# Altium schematic sheet ControlBrick2_0.SchDoc
size A4
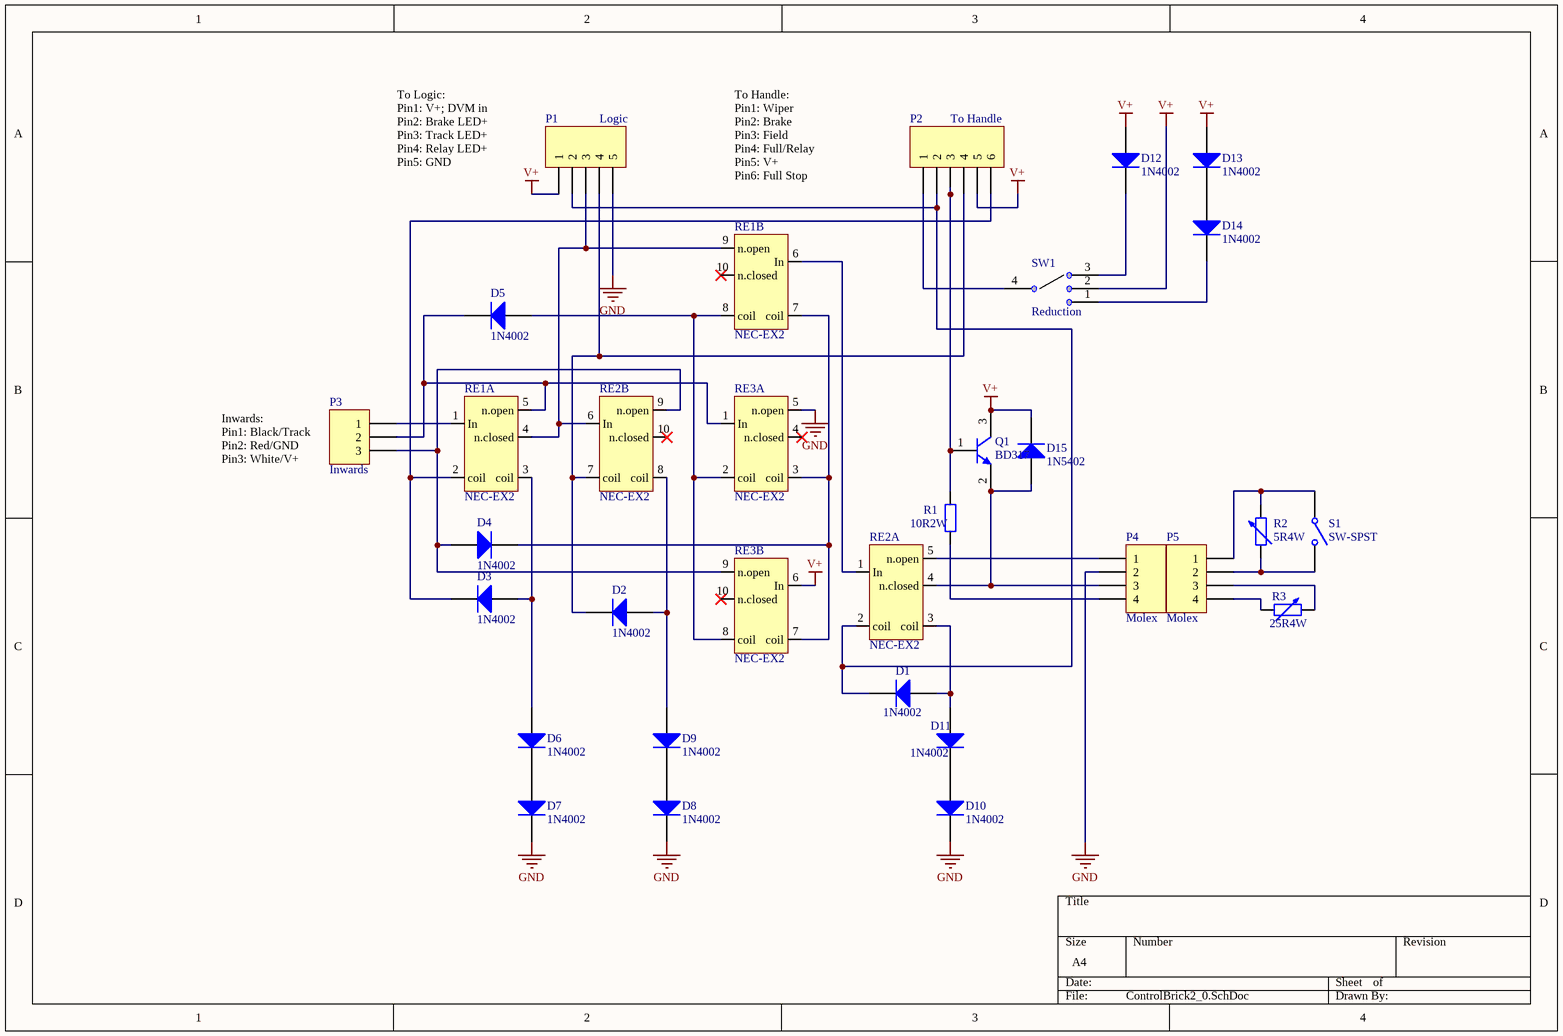
[diagram p0: ControlBrick2_0.SchDoc]

## Parts
D1  1N4002  [StdDiode]
D2  1N4002  [StdDiode]
D3  1N4002  [StdDiode]
D4  1N4002  [StdDiode]
D5  1N4002  [StdDiode]
D6  1N4002  [StdDiode]
D7  1N4002  [StdDiode]
D8  1N4002  [StdDiode]
D9  1N4002  [StdDiode]
D10  1N4002  [StdDiode]
D11  1N4002  [StdDiode]
D12  1N4002  [StdDiode]
D13  1N4002  [StdDiode]
D14  1N4002  [StdDiode]
D15  1N5402  [BigDiode]
P1  Logic  [HDR1X5]
P2  To Handle  [Interconnect]
P3  Inwards  [Inwards]
P4  Molex  [Molex_4x50.8]
P5  Molex  [HDR1X4]
Q1  BD317  [TO-3]
R1  10R2W  [2Wres]
R2  value 5R4W  [AXIAL-0.6]  (hidden comment: Res Adj2)
R3  value 25R4W  [AXIAL-0.6]  (hidden comment: Res Adj2)
RE1  NEC-EX2  [NEC-EX2]  (parts A,B of 2)
RE2  NEC-EX2  [NEC-EX2]  (parts A,B of 2)
RE3  NEC-EX2  [NEC-EX2]  (parts A,B of 2)
S1  SW-SPST  [Switch SPST]
SW1  Reduction  [Switch SP3T]

## Nets
GND: D7.2(K) D8.2(K) D10.2(K) P1.5 P4.2 RE3.5(n.open)
V+: D12.1(A) D13.1(A) D15.2(K) P1.1 P2.5 Q1.3(C) RE3.6(In) SW1.2
NetD1_1: D1.1(A) D11.1(A) RE2.3(coil)
NetD1_2: D1.2(K) P1.2 P2.2 RE2.2(coil)
NetD2_1: D2.1(A) D9.1(A) RE2.8(coil)
NetD2_2: D2.2(K) P1.4 P2.4 RE2.7(coil)
NetD3_1: D3.1(A) D6.1(A) RE1.3(coil)
NetD3_2: D3.2(K) P2.6 RE1.2(coil)
NetD4_1: D4.1(A) P3.3 RE2.9(n.open) RE3.9(n.open)
NetD4_2: D4.2(K) RE1.7(coil) RE3.3(coil) RE3.7(coil)
NetD5_1: D5.1(A) RE1.8(coil) RE3.2(coil) RE3.8(coil)
NetD5_2: D5.2(K) P3.2 RE1.5(n.open) RE3.1(In)
NetD6_2: D6.2(K) D7.1(A)
NetD8_1: D8.1(A) D9.2(K)
NetD10_1: D10.1(A) D11.2(K)
NetD12_2: D12.2(K) SW1.3
NetD13_2: D13.2(K) D14.1(A)
NetD14_2: D14.2(K) SW1.1
NetD15_1: D15.1(A) P4.3 Q1.2(E) RE2.4(n.closed)
NetP1_3: P1.3 RE1.4(n.closed) RE1.9(n.open) RE2.6(In)
NetP2_1: P2.1 SW1.4
NetP2_3: P2.3 Q1.1(B) R1.2
NetP3_1: P3.1 RE1.1(In)
NetP4_1: P4.1 RE2.5(n.open)
NetP4_4: P4.4 R1.1
NetP5_1: P5.1 R2.2 S1.1(COMMON)
NetP5_2: P5.2 R2.1 S1.2(NO)
NetP5_3: P5.3 R3.2
NetP5_4: P5.4 R3.1
NetRE1_6: RE1.6(In) RE2.1(In)

Not connected (* = marked no-connect by the designer): RE1 10(n.closed)*; RE2 10(n.closed)*; RE3 4(n.closed)* 10(n.closed)*

## Notes on the sheet
- (near P1) To Logic:
  Pin1: V+; DVM in
  Pin2: Brake LED+
  Pin3: Track LED+
  Pin4: Relay LED+
  Pin5: GND
- To Handle:
  Pin1: Wiper
  Pin2: Brake
  Pin3: Field
  Pin4: Full/Relay
  Pin5: V+
  Pin6: Full Stop
- Inwards:
  Pin1: Black/Track
  Pin2: Red/GND
  Pin3: White/V+

## Library data of the parts
D1-D14 = Diode 1N4002: 1 Amp General Purpose Rectifier; Published: 8-Jun-2000; LatestRevisionDate: 17-Jul-2002; LatestRevisionNote: Re-released for DXP Platform.; DatasheetVersion: 1998; PackageVersion: Aug-1999; PackageReference: DO-41; Publisher: Altium Limited; PackageDescription: Diode, Axial; Body 5.2 x 2.7 mm (LxDia. max), Lead Dia. 0.86 mm (max); Code_JEDEC: DO-204-AL; ComponentLink1Description: Manufacturer Link; ComponentLink1URL: http://www.fairchildsemi.com/; ComponentLink2Description: Datasheet; ComponentLink2URL: http://www.fairchildsemi.com/ds/1N%2F1N4001.pdf
D15 = Diode 1N5402: 3 Amp General Purpose Rectifier; Published: 8-Jun-2000; LatestRevisionDate: 17-Jul-2002; LatestRevisionNote: Re-released for DXP Platform.; DatasheetVersion: 1998; PackageVersion: Aug-1999; PackageReference: DO-201AD; Publisher: Altium Limited; PackageDescription: Diode, Axial; Body 9.5 x 5.6 mm (LxDia. max), Lead Dia. 1.32 mm (max); ComponentLink1Description: Manufacturer Link; ComponentLink1URL: http://www.fairchildsemi.com/; ComponentLink2Description: Datasheet; ComponentLink2URL: http://www.fairchildsemi.com/ds/1N%2F1N5400.pdf
P1 = Header 5: Header, 5-Pin; LatestRevisionDate: 17-Jul-2002; LatestRevisionNote: Re-released for DXP Platform.; Publisher: Altium Limited
P2 = Header 6: Header, 6-Pin; LatestRevisionDate: 17-Jul-2002; LatestRevisionNote: Re-released for DXP Platform.; Publisher: Altium Limited
P3 = Header 3: Header, 3-Pin; LatestRevisionDate: 17-Jul-2002; LatestRevisionNote: Re-released for DXP Platform.; Publisher: Altium Limited
P4 P5 = Header 4: Header, 4-Pin; LatestRevisionDate: 17-Jul-2002; LatestRevisionNote: Re-released for DXP Platform.; Publisher: Altium Limited
Q1 = 2N3904: NPN General Purpose Amplifier; Published: 8-Jun-2000; LatestRevisionDate: 15-Jan-2003; LatestRevisionNote: PCB Footprint 'BCY-W3/D4.7' replaced; DatasheetVersion: 1997; PackageVersion: Sep-1998; PackageReference: TO-92A; Publisher: Altium Limited; PackageDescription: TO, Flat Index; 3 In-Line, Axial Leads; Body Dia. 4.5mm; Leads 0.51 x 0.48 mm (max); ComponentLink1Description: Manufacturer Link; ComponentLink1URL: http://www.fairchildsemi.com/; ComponentLink2Description: Datasheet; ComponentLink2URL: http://www.fairchildsemi.com/ds/2N%2F2N3904.pdf
R1 = Res2: Resistor; Published: 8-Jun-2000; LatestRevisionDate: 17-Jul-2002; LatestRevisionNote: Re-released for DXP Platform.; PackageReference: AXIAL-0.4; Publisher: Altium Limited; PackageDescription: Axial Device, Thru-Hole; 2 Leads; 0.4 in Pin Spacing
R2 R3 = Res Adj2: Variable Resistor; Set Position: 0.5; Published: 8-Jun-2000; LatestRevisionDate: 17-Jul-2002; LatestRevisionNote: Re-released for DXP Platform.; PackageReference: AXIAL-0.6; Publisher: Altium Limited; PackageDescription: Axial Device, Thru-Hole; 2 Leads; 0.6 in Pin Spacing
RE1 RE2 = Component_2
RE3 = NEC-EX2-2U1S
S1 = SW-SPST: Single-Pole, Single-Throw Switch; Published: 24-Mar-1999; LatestRevisionDate: 17-Jul-2002; LatestRevisionNote: Re-released for DXP Platform.; PackageReference: SPST-2; Publisher: Altium Limited; PackageDescription: Switch; 2 Leads
SW1 = 3Way